# EAGLE design Boss HM-2 (EAGLE 7.1.0)
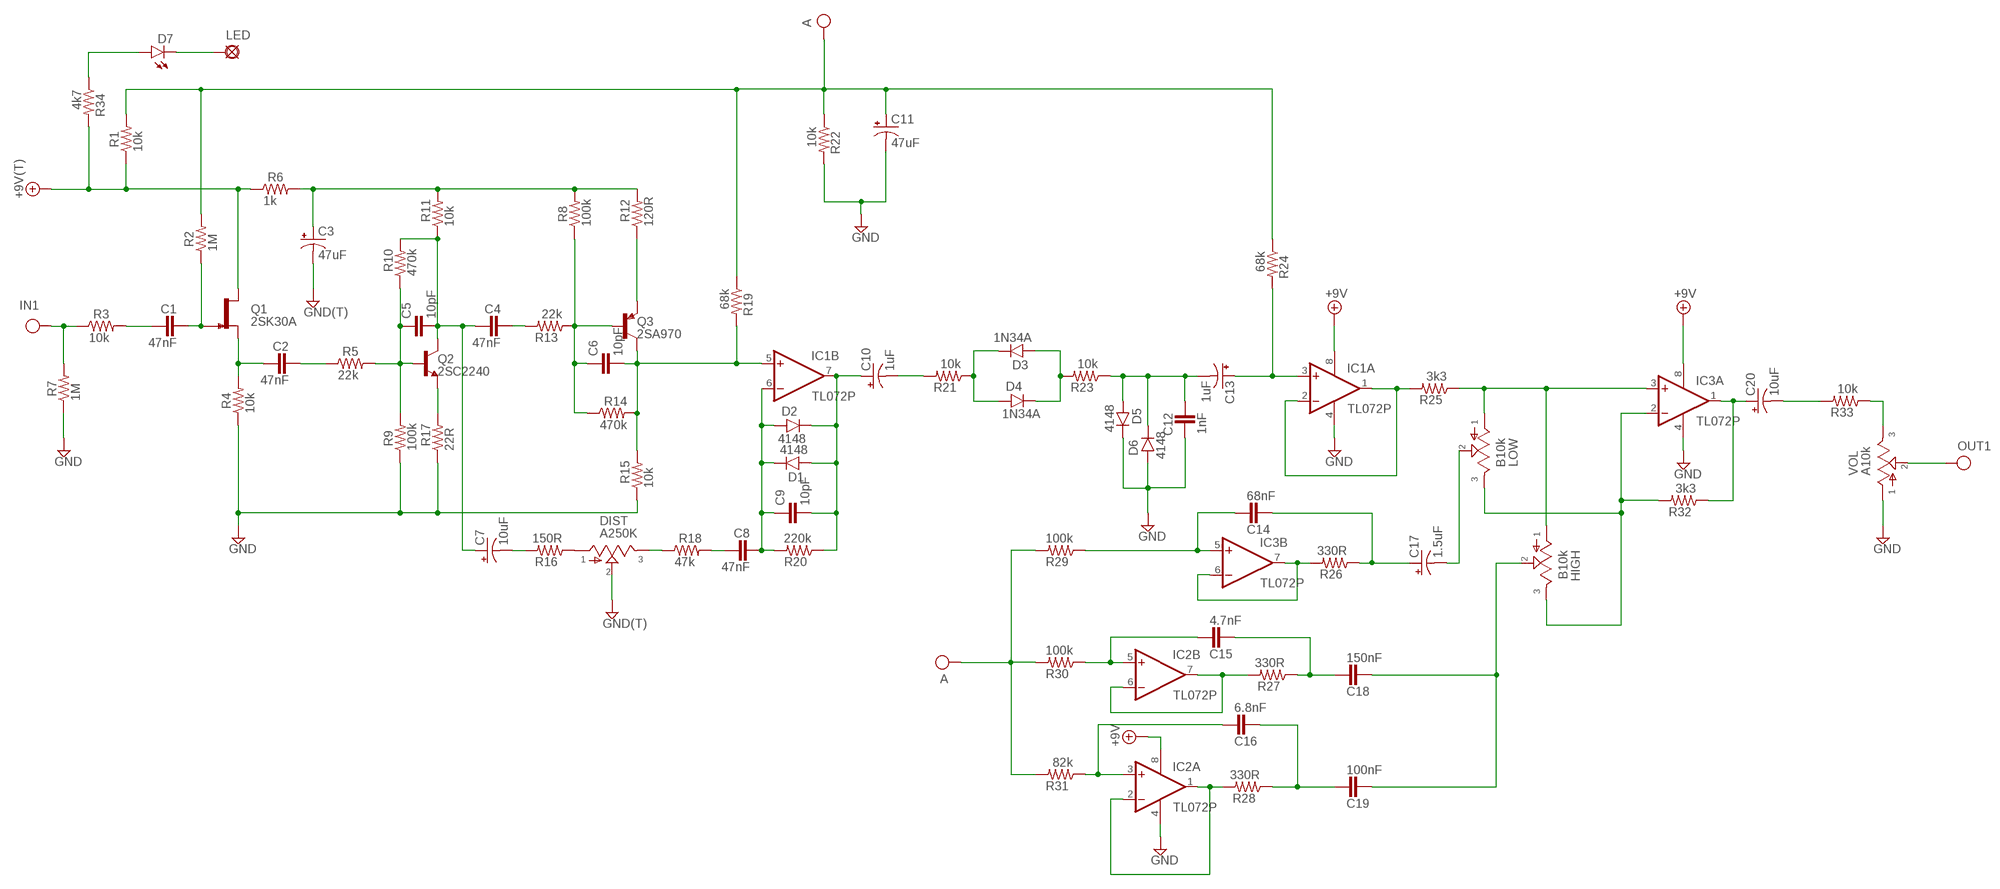
[diagram p0: schematic, sheet 1]

## Parts
+9V1  +9V(T)  [SQUARE]
C1  47nF  072X0252  [072X025]
C2  47nF  072X0252  [072X025]
C3  47uF  0501  [050_020_1]
C4  47nF  072X0252  [072X025]
C5  10pF  050X030_0251  [050X030_025]
C6  10pF  050X030_0251  [050X030_025]
C7  10uF  0501  [050_020_1]
C8  47nF  072X0252  [072X025]
C9  10pF  050X030_0251  [050X030_025]
C10  1uF  0501  [050_020_1]
C11  47uF  0501  [050_020_1]
C12  1nF  072X0252  [072X025]
C13  1uF  0501  [050_020_1]
C14  68nF  072X0252  [072X025]
C15  4.7nF  072X0252  [072X025]
C16  6.8nF  072X0252  [072X025]
C17  1.5uF  0501  [050_020_1]
C18  150nF  072X0252  [072X025]
C19  100nF  072X0252  [072X025]
C20  10uF  0501  [050_020_1]
D1  4148  1N4148-3  [DO35-3]
D2  4148  1N4148-3  [DO35-3]
D3  1N34A  DO07  [DO07]
D4  1N34A  DO07  [DO07]
D5  4148  1N4148-3  [DO35-3]
D6  4148  1N4148-3  [DO35-3]
D7  LED3MM  [LED3MM]
DIST  A250K  POT16MM_PCB_PADS  [16MM_PCB_PADS]
GND1  GND(T)  [SQUARE]
GND2  GND(T)  [SQUARE]
HIGH  B10k  POT16MM_PCB_PADS  [16MM_PCB_PADS]
IC1  TL072P  [DIL08]
IC2  TL072P  [DIL08]
IC3  TL072P  [DIL08]
IN1  IN(T)  [SQUARE]
LED  PAD  [SQUARE]
LOW  B10k  POT16MM_PCB_PADS  [16MM_PCB_PADS]
OUT1  OUT(T)  [SQUARE]
Q1  2SK30A  [TO92-]
Q2  2SC2240  2N5089  [TO92-]
Q3  2SA970  2SA733  [TO92-]
R1  10k  6MM.3  [R0207/3]
R2  1M  6MM.3  [R0207/3]
R3  10k  6MM.3  [R0207/3]
R4  10k  6MM.3  [R0207/3]
R5  22k  6MM.3  [R0207/3]
R6  1k  6MM.3  [R0207/3]
R7  1M  6MM.3  [R0207/3]
R8  100k  6MM.3  [R0207/3]
R9  100k  6MM.3  [R0207/3]
R10  470k  6MM.3  [R0207/3]
R11  10k  6MM.3  [R0207/3]
R12  120R  6MM.3  [R0207/3]
R13  22k  6MM.3  [R0207/3]
R14  470k  6MM.3  [R0207/3]
R15  10k  6MM.3  [R0207/3]
R16  150R  6MM.3  [R0207/3]
R17  22R  6MM.3  [R0207/3]
R18  47k  6MM.3  [R0207/3]
R19  68k  6MM.3  [R0207/3]
R20  220k  6MM.3  [R0207/3]
R21  10k  6MM.3  [R0207/3]
R22  10k  6MM.3  [R0207/3]
R23  10k  6MM.3  [R0207/3]
R24  68k  6MM.3  [R0207/3]
R25  3k3  6MM.3  [R0207/3]
R26  330R  6MM.3  [R0207/3]
R27  330R  6MM.3  [R0207/3]
R28  330R  6MM.3  [R0207/3]
R29  100k  6MM.3  [R0207/3]
R30  100k  6MM.3  [R0207/3]
R31  82k  6MM.3  [R0207/3]
R32  3k3  6MM.3  [R0207/3]
R33  10k  6MM.3  [R0207/3]
R34  4k7  6MM.3  [R0207/3]
VOL  A10k  POT16MM_PCB_PADS  [16MM_PCB_PADS]

## Nets
+9V: +9V1.1(+9V) IC1.8(P:V+) IC2.8(P:V+) IC3.8(P:V+) Q1.3(D) R1.1 R6.1 R34.2
A: C11.+ R1.2 R2.2 R19.1 R22.1 R24.1 R29.2 R30.2 R31.2
GND: C3.- C11.- C12.1 D5.C D6.A DIST.2 GND1.1(GND) GND2.1(GND) IC1.4(P:V-) IC2.4(P:V-) IC3.4(P:V-) R4.1 R7.1 R9.1 R15.1 R17.1 R22.2 VOL.1
IN: IN1.1(IN) R3.1 R7.2
N$1: C1.1 R3.2
N$2: C5.1 Q2.2(B) R5.2 R9.2 R10.1
N$3: C1.2 Q1.2(G) R2.1
N$4: C3.+ R6.2 R8.2 R11.2 R12.2
N$5: C2.1 Q1.1(S) R4.2
N$6: C2.2 R5.1
N$7: C4.1 C5.2 C7.+ Q2.1(C) R10.2 R11.1
N$8: Q2.3(E) R17.2
N$9: C4.2 R13.2
N$10: C7.- R16.2
N$11: C6.1 Q3.1(B) R8.1 R13.1 R14.1
N$12: C6.2 IC1.5(B:+IN) Q3.2(C) R14.2 R15.2 R19.2
N$13: Q3.3(E) R12.1
N$14: DIST.1 R16.1
N$15: DIST.3 R18.1
N$16: C8.2 C9.1 D1.C D2.A IC1.6(B:-IN) R20.2
N$17: C8.1 R18.2
N$18: D7.A R34.1
N$19: C9.2 C10.+ D1.A D2.C IC1.7(B:OUT) R20.1
N$20: C10.- R21.2
N$21: D3.C D4.A R21.1
N$22: D3.A D4.C R23.2
N$23: C12.2 C13.- D5.A D6.C R23.1
N$24: C13.+ IC1.3(A:+IN) R24.2
N$25: IC1.1(A:OUT) IC1.2(A:-IN) R25.2
N$26: IC2.6(B:-IN) IC2.7(B:OUT) R27.2
N$27: C14.2 IC3.5(B:+IN) R29.1
N$28: C15.2 IC2.5(B:+IN) R30.1
N$29: C16.2 IC2.3(A:+IN) R31.1
N$30: D7.K(C) LED.1(PAD)
N$31: IC2.1(A:OUT) IC2.2(A:-IN) R28.2
N$32: IC3.6(B:-IN) IC3.7(B:OUT) R26.2
N$33: C14.1 C17.+ R26.1
N$34: C15.1 C18.2 R27.1
N$35: C16.1 C19.2 R28.1
N$36: C18.1 C19.1 HIGH.2
N$37: C17.- LOW.2
N$38: HIGH.1 IC3.3(A:+IN) LOW.1 R25.1
N$39: HIGH.3 IC3.2(A:-IN) LOW.3 R32.2
N$40: C20.+ IC3.1(A:OUT) R32.1
N$41: C20.- R33.2
N$42: R33.1 VOL.3
OUT: OUT1.1(OUT) VOL.2

## Library data of the parts
+9V1 = mb_supply:+9V(T): +9V Voltage Supply use this to hook up +9v throughout a schematic instead of running wire automatically labels the net "+9v" adds a hookup pad to the circuit board
C1 C2 C4 C8 C12 C14-C16 C18 C19 = mb_caps-box:072X025: 1000pF - 0.47uF WIMA MKP2 63, 100V: 1000pF - 0.015uF; MKS2 50V: 0.33 - 0.47uF; 63V: 1000pF - 0.22uF;
C3 C7 C10 C11 C13 C17 C20 = mb_caps-electro:050: 0.22 - 100uF Xicon values at Mouser.com: 10V: 10 - 100uF; 16V: 2.2 - 47uF; 25V: 0.47 - 47uF; 50V: 0.22 - 22uF
C5 C6 C9 = mb_caps-ceramic:050X030_025: 47 - 120pF Xicon Ceramic Disc 2.5mm lead spacing
D1 D2 D5 D6 = mb_diodes:1N4148: Fast Switching Diode DO-35 glass case a.k.a. 1N914
D3 D4 = mb_diodes:DO07: DO-07 Package for 1N34A and similar Ge diodes
D7 = mb_diodes:LED
DIST HIGH LOW VOL = mb_pots:POT: Potentiometers the arrow indicates the clockwise motion of th wiper (lug 2) fully counter clockwise there is no resistance between lugs 1 and 2 fully clockwise the resistance between lugs 1 and 2 is the value of the pot
GND1 GND2 = mb_supply:GND(T): Ground use this to hook up ground (GND) throughout a schematic instead of running wire automatically labels the net "GND" adds a hookup pad to the circuit board (you can use several)
IC1-IC3 = mb_ics:TL072: OP AMP
IN1 = mb_supply:IN(T): Input obsolete: use Pad instead and label net shematic input label with circuit board terminal/pad generally used only once on a schematic (because this device labels the net "IN" in the same way as a voltage supply or ground net)
LED = mb_supply:PAD: PAD use this package for pads with any purpose, including input, output, send or return various pad shapes: round, square, octogonal, long, and long offset
OUT1 = mb_supply:OUT(T): Output obsolete: use Pad instead and label net output label with circuit board terminal/pad usually appears only once on a schematic
Q1 = mb_trans:2SK30A
Q2 = mb_trans:2N5089: NPN TRANSISTOR EBC pinout also works for 2N3565
Q3 = mb_trans:2SA733
R1-R34 = mb_resistors:6MM: 6mm Resistors Leads spaced 1-6 holes apart for 0.1" perfboard. Suitable for 1/4 watt resistors.

## Board
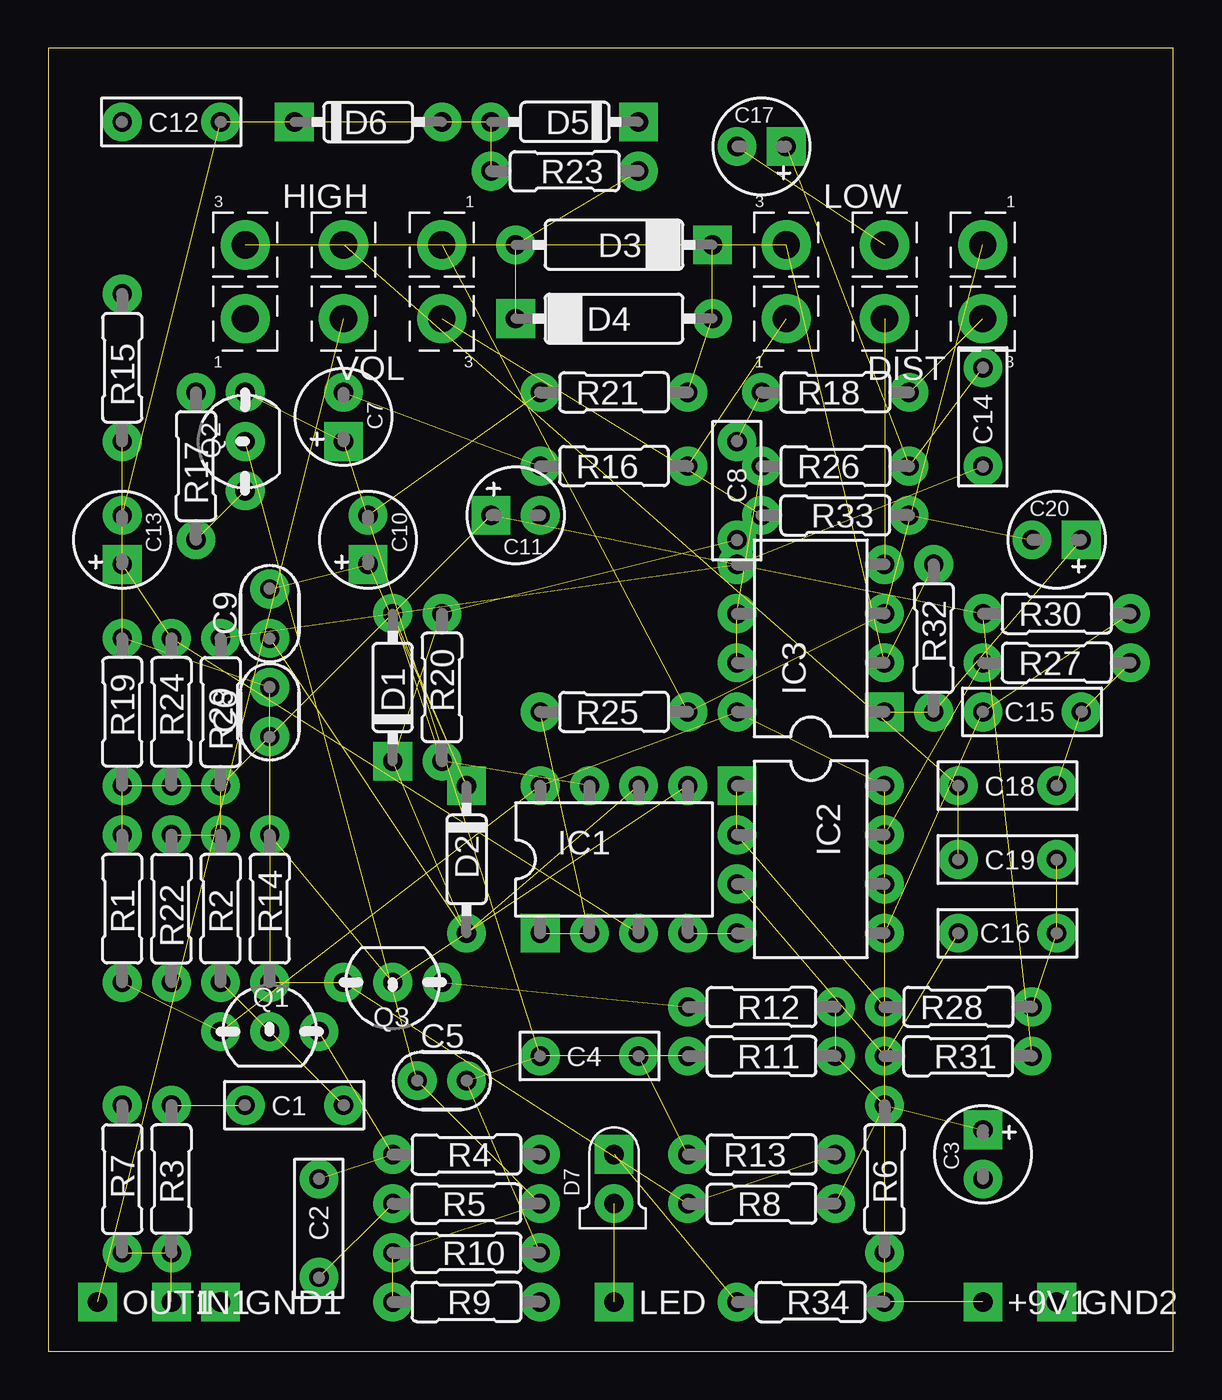
[diagram p1: board, top side]
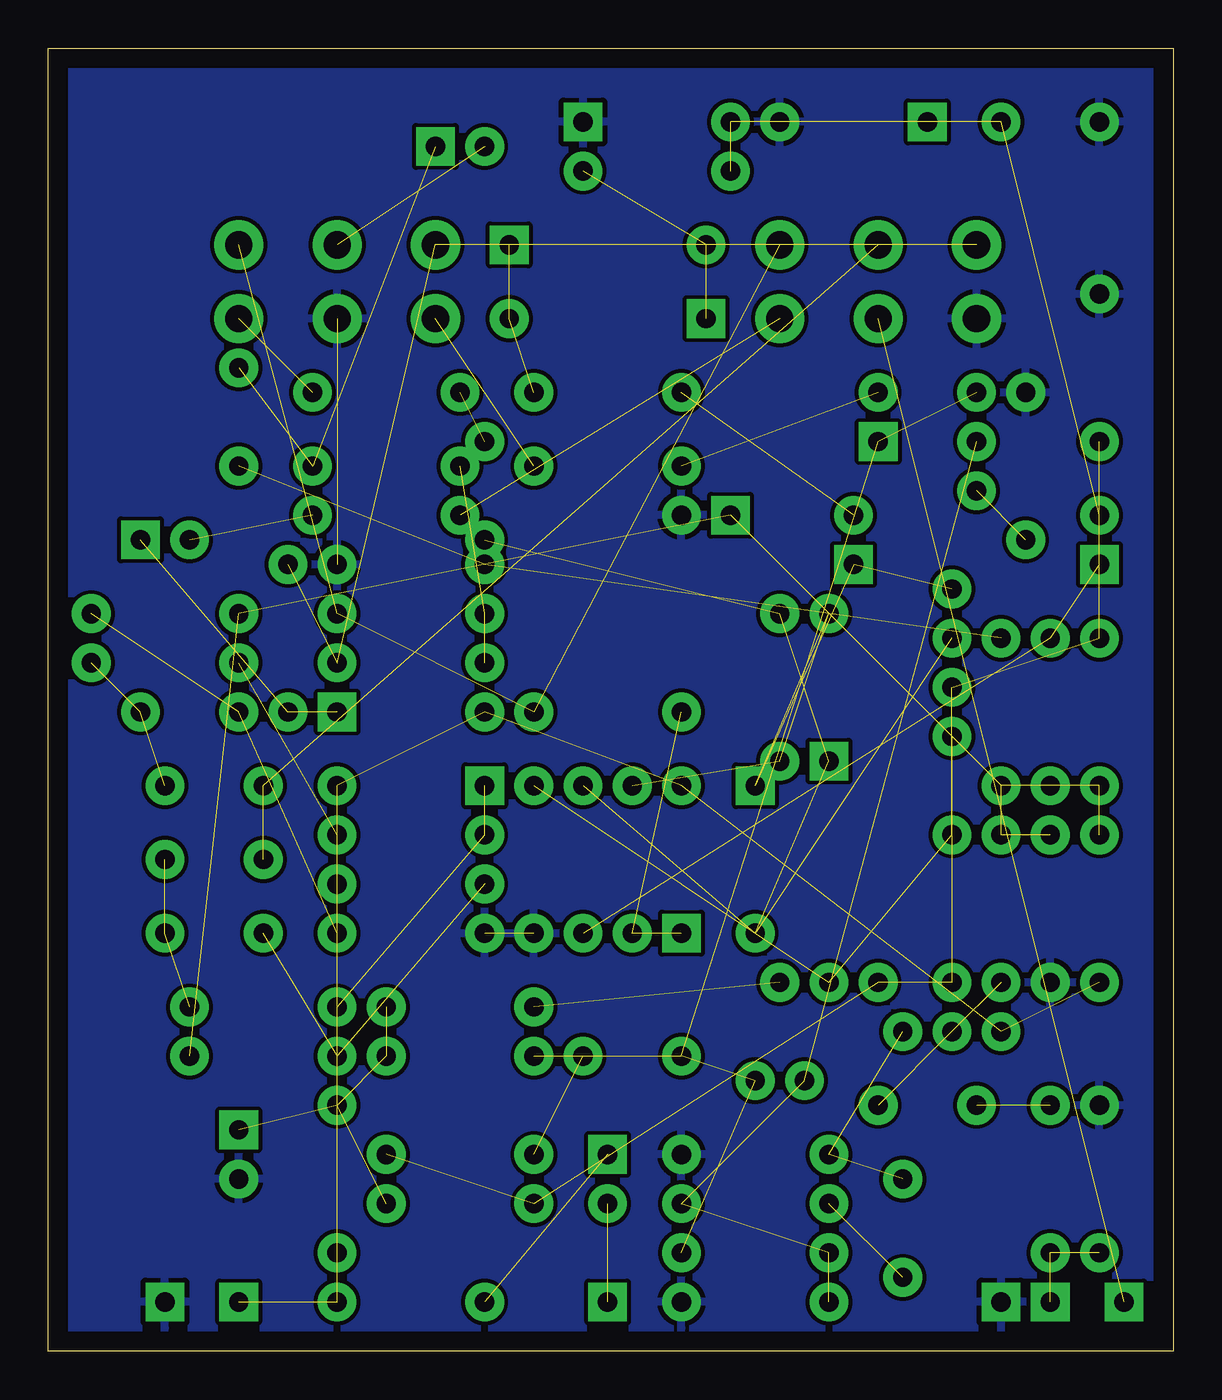
[diagram p2: board, bottom side, seen from below]

Size 58.09 x 67.3 mm. Coordinates in mm from the lower left corner, seen from the top.
Outline: 0,0 58.09,0 58.09,67.3 0,67.3 0,0
Copper layers (1*16): Top 0.035mm / dielectric 1.5mm / Bottom 0.035mm
Design rules "default": minimum track width 10mil, minimum drill 24mil, track to track 8mil, track to pad 8mil, pad to pad 8mil, via to via 8mil, smd to smd 8mil, copper to edge 40mil, drill to drill 8mil, minimum pad ring 10mil, minimum via ring 8mil, stop-mask expansion 4mil, vias tented up to drill 0mil, thermal gap 10mil

### Footprints (pad centres in the part's own frame; a part is rotated, then mirrored left to right if it is on the bottom)
SQUARE = drill 1 pad 2 square: 1 0,0
072X025 = drill 1 pad 2: 1 -2.54,0; 2 2.54,0
050_020_1 = drill 1 pad 2 square: + -1.27,0 | drill 1 pad 2: - 1.27,0
050X030_025 = drill 1 pad 2: 1 -1.27,0; 2 1.27,0
DO35-3 = drill 1 pad 2: A 3.81,0 | drill 1 pad 2 square: C -3.81,0
DO07 = drill 1 pad 2: A 5.08,0 | drill 1 pad 2 square: C -5.08,0
LED3MM = drill 1 pad 2 square: A -1.27,0 | drill 1 pad 2: K 1.27,0
16MM_PCB_PADS = drill 1.4 pad 2.54: 1 5.08,0; 2 0,0; 3 -5.08,0
DIL08 = drill 1 pad 2 square: 1 -3.81,-3.81 | drill 1 pad 2: 2 -1.27,-3.81; 3 1.27,-3.81; 4 3.81,-3.81; 5 3.81,3.81; 6 1.27,3.81; 7 -1.27,3.81; 8 -3.81,3.81
TO92- = drill 1 pad 2: 1 2.54,0; 2 0,0; 3 -2.54,0
R0207/3 = drill 1 pad 2: 1 -3.81,0; 2 3.81,0

### Placement (x,y rotation side)
+9V1  48.26,2.54 0 top
C1  12.7,12.7 0 top
C2  13.97,6.35 270 top
C3  48.26,10.16 270 top
C4  27.94,15.24 0 top
C5  20.32,13.97 0 top
C6  11.43,33.02 90 top
C7  15.24,48.26 90 top
C8  35.56,44.45 270 top
C9  11.43,38.1 90 top
C10  16.51,41.91 90 top
C11  24.13,43.18 0 top
C12  6.35,63.5 0 top
C13  3.81,41.91 90 top
C14  48.26,48.26 270 top
C15  50.8,33.02 180 top
C16  49.53,21.59 180 top
C17  36.83,62.23 180 top
C18  49.53,29.21 0 top
C19  49.53,25.4 0 top
C20  52.07,41.91 180 top
D1  17.78,34.29 90 top
D2  21.59,25.4 270 top
D3  29.21,57.15 180 top
D4  29.21,53.34 0 top
D5  26.67,63.5 180 top
D6  16.51,63.5 0 top
D7  29.21,8.89 270 top
DIST  43.18,53.34 180 top
GND1  8.89,2.54 0 top
GND2  52.07,2.54 0 top
HIGH  15.24,57.15 0 top
IC1  29.21,25.4 0 top
IC2  39.37,25.4 270 top
IC3  39.37,36.83 90 top
IN1  6.35,2.54 0 top
LED  29.21,2.54 0 top
LOW  43.18,57.15 0 top
OUT1  2.54,2.54 0 top
Q1  11.43,16.51 0 top
Q2  10.16,46.99 90 top
Q3  17.78,19.05 180 top
R1  3.81,22.86 90 top
R2  8.89,22.86 90 top
R3  6.35,8.89 90 top
R4  21.59,10.16 180 top
R5  21.59,7.62 0 top
R6  43.18,8.89 90 top
R7  3.81,8.89 270 top
R8  36.83,7.62 0 top
R9  21.59,2.54 180 top
R10  21.59,5.08 0 top
R11  36.83,15.24 0 top
R12  36.83,17.78 0 top
R13  36.83,10.16 180 top
R14  11.43,22.86 90 top
R15  3.81,50.8 270 top
R16  29.21,45.72 180 top
R17  7.62,45.72 270 top
R18  40.64,49.53 180 top
R19  3.81,33.02 90 top
R20  20.32,34.29 90 top
R21  29.21,49.53 180 top
R22  6.35,22.86 270 top
R23  26.67,60.96 0 top
R24  6.35,33.02 90 top
R25  29.21,33.02 180 top
R26  40.64,45.72 180 top
R27  52.07,35.56 180 top
R28  46.99,17.78 180 top
R29  8.89,33.02 270 top
R30  52.07,38.1 180 top
R31  46.99,15.24 0 top
R32  45.72,36.83 90 top
R33  40.64,43.18 0 top
R34  39.37,2.54 0 top
VOL  15.24,53.34 180 top

### Tracks (layer width: path | path; a pad name or v marks a point on that pad's centre or on a via)
+9V  (7 unrouted)
A  (8 unrouted)
GND  (2 unrouted)
  pour Bottom: 0,67.31 0,0 58.42,0 58.42,67.31
IN  (2 unrouted)
N$1  (1 unrouted)
N$2  (4 unrouted)
N$3  (2 unrouted)
N$4  (4 unrouted)
N$5  (2 unrouted)
N$6  (1 unrouted)
N$7  (5 unrouted)
N$8  (1 unrouted)
N$9  (1 unrouted)
N$10  (1 unrouted)
N$11  (4 unrouted)
N$12  (5 unrouted)
N$13  (1 unrouted)
N$14  (1 unrouted)
N$15  (1 unrouted)
N$16  (5 unrouted)
N$17  (1 unrouted)
N$18  (1 unrouted)
N$19  (5 unrouted)
N$20  (1 unrouted)
N$21  (2 unrouted)
N$22  (2 unrouted)
N$23  (4 unrouted)
N$24  (2 unrouted)
N$25  (2 unrouted)
N$26  (2 unrouted)
N$27  (2 unrouted)
N$28  (2 unrouted)
N$29  (2 unrouted)
N$30  (1 unrouted)
N$31  (2 unrouted)
N$32  (2 unrouted)
N$33  (2 unrouted)
N$34  (2 unrouted)
N$35  (2 unrouted)
N$36  (2 unrouted)
N$37  (1 unrouted)
N$38  (3 unrouted)
N$39  (3 unrouted)
N$40  (2 unrouted)
N$41  (1 unrouted)
N$42  (1 unrouted)
OUT  (1 unrouted)